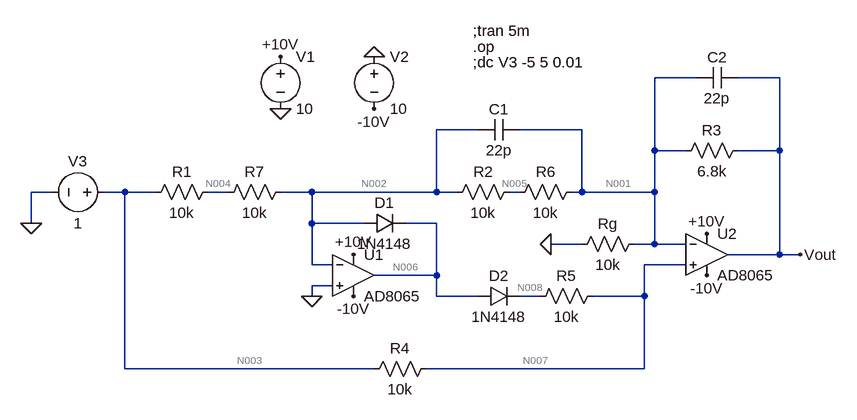
[diagram p0: schematic Etaj4.asc]
Etaj4.asc, the LTspice schematic file:
Version 4.1
SHEET 1 1336 680
WIRE 736 -96 672 -96
WIRE 864 -96 800 -96
WIRE 400 -16 336 -16
WIRE 560 -16 464 -16
WIRE 672 16 672 -96
WIRE 720 16 672 16
WIRE 864 16 864 -96
WIRE 864 16 800 16
WIRE -256 80 -288 80
WIRE -144 80 -176 80
WIRE -96 80 -144 80
WIRE 16 80 -16 80
WIRE 144 80 96 80
WIRE 336 80 336 -16
WIRE 336 80 144 80
WIRE 368 80 336 80
WIRE 464 80 448 80
WIRE 560 80 560 -16
WIRE 560 80 544 80
WIRE 672 80 672 16
WIRE 672 80 560 80
WIRE -288 128 -288 80
WIRE 144 128 144 80
WIRE 224 128 144 128
WIRE 336 128 288 128
WIRE 560 160 512 160
WIRE 672 160 672 80
WIRE 672 160 640 160
WIRE 720 160 672 160
WIRE 864 176 864 16
WIRE 864 176 784 176
WIRE 896 176 864 176
WIRE 144 192 144 128
WIRE 176 192 144 192
WIRE 720 192 656 192
WIRE 336 208 336 128
WIRE 336 208 240 208
WIRE 176 224 144 224
WIRE 144 240 144 224
WIRE 336 240 336 208
WIRE 400 240 336 240
WIRE 496 240 464 240
WIRE 656 240 656 192
WIRE 656 240 576 240
WIRE -144 352 -144 80
WIRE 240 352 -144 352
WIRE 656 352 656 240
WIRE 656 352 320 352
FLAG 144 240 0
FLAG 896 176 Vout
FLAG 96 -48 0
FLAG 240 -128 0
FLAG 96 -128 +10V
FLAG 208 176 +10V
FLAG 752 144 +10V
FLAG 240 -48 -10V
FLAG 208 240 -10V
FLAG 752 208 -10V
FLAG -288 128 0
FLAG 512 160 0
SYMBOL res 0 64 R90
WINDOW 0 0 56 VBottom 2
WINDOW 3 32 56 VTop 2
SYMATTR InstName R1
SYMATTR Value 10k
SYMBOL OpAmps\\AD8065 208 144 R0
SYMATTR InstName U1
SYMBOL diode 224 144 R270
WINDOW 0 32 32 VTop 2
WINDOW 3 0 32 VBottom 2
SYMATTR InstName D1
SYMATTR Value 1N4148
SYMBOL diode 400 256 R270
WINDOW 0 32 32 VTop 2
WINDOW 3 0 32 VBottom 2
SYMATTR InstName D2
SYMATTR Value 1N4148
SYMBOL res 336 336 R90
WINDOW 0 0 56 VBottom 2
WINDOW 3 32 56 VTop 2
SYMATTR InstName R4
SYMATTR Value 10k
SYMBOL res 464 64 R90
WINDOW 0 0 56 VBottom 2
WINDOW 3 32 56 VTop 2
SYMATTR InstName R2
SYMATTR Value 10k
SYMBOL OpAmps\\AD8065 752 112 R0
SYMATTR InstName U2
SYMBOL res 816 0 R90
WINDOW 0 0 56 VBottom 2
WINDOW 3 32 56 VTop 2
SYMATTR InstName R3
SYMATTR Value 6.8k
SYMBOL voltage 96 -144 R0
WINDOW 123 0 0 Left 0
WINDOW 39 0 0 Left 0
SYMATTR InstName V1
SYMATTR Value 10
SYMBOL voltage 240 -144 R0
WINDOW 123 0 0 Left 0
WINDOW 39 0 0 Left 0
SYMATTR InstName V2
SYMATTR Value 10
SYMBOL voltage -160 80 R90
WINDOW 0 -32 56 VBottom 2
WINDOW 3 32 56 VTop 2
WINDOW 123 0 0 Left 0
WINDOW 39 0 0 Left 0
SYMATTR InstName V3
SYMATTR Value 1
SYMBOL cap 464 -32 R90
WINDOW 0 0 32 VBottom 2
WINDOW 3 32 32 VTop 2
SYMATTR InstName C1
SYMATTR Value 22p
SYMBOL cap 800 -112 R90
WINDOW 0 0 32 VBottom 2
WINDOW 3 32 32 VTop 2
SYMATTR InstName C2
SYMATTR Value 22p
SYMBOL res 656 144 R90
WINDOW 0 0 56 VBottom 2
WINDOW 3 32 56 VTop 2
SYMATTR InstName Rg
SYMATTR Value 10k
SYMBOL res 592 224 R90
WINDOW 0 0 56 VBottom 2
WINDOW 3 32 56 VTop 2
SYMATTR InstName R5
SYMATTR Value 10k
SYMBOL res 560 64 R90
WINDOW 0 0 56 VBottom 2
WINDOW 3 32 56 VTop 2
SYMATTR InstName R6
SYMATTR Value 10k
SYMBOL res 112 64 R90
WINDOW 0 0 56 VBottom 2
WINDOW 3 32 56 VTop 2
SYMATTR InstName R7
SYMATTR Value 10k
TEXT 392 -168 Left 2 !;tran 5m
TEXT 392 -144 Left 2 !.op
TEXT 392 -120 Left 2 !;dc V3 -5 5 0.01

The netlist it stands for:
* Etaj4.asc
R1 N004 N003 10k
X§U1 0 N002 +10V -10V N006 AD8065  ; pins In+ In- V+ V- OUT
D1 N002 N006 1N4148
D2 N006 N008 1N4148
R4 N007 N003 10k
R2 N005 N002 10k
X§U2 N007 N001 +10V -10V Vout AD8065  ; pins In+ In- V+ V- OUT
R3 Vout N001 6.8k
V1 +10V 0 10
V2 0 -10V 10
V3 N003 0 1
C1 N001 N002 22p
C2 Vout N001 22p
Rg N001 0 10k
R5 N007 N008 10k
R6 N001 N005 10k
R7 N002 N004 10k
.model D D
.lib standard.dio
;tran 5m
.op
;dc V3 -5 5 0.01
.backanno
.end

* Results of the author's LTspice run, read from the files saved beside the schematic
* Operating Point:
*   V(n003) = 1 V
*   V(+10v) = 10 V
*   V(-10v) = -10 V
*   V(n008) = 999.9 mV
*   V(n001) = 1 V
*   V(n004) = 500.2 mV
*   V(n002) = 401.1 µV
*   V(n006) = -479.5 mV
*   V(n007) = 1 V
*   V(n005) = 500.4 mV
*   V(vout) = 2.021 V
*   I(R4) = -2.524 nA
*   I(R3) = 150 µA
*   I(V1) = -12.95 mA
*   I(R6) = 50 µA
*   I(R1) = -49.98 µA
*   I(D2) = -2.521 nA
*   I(V3) = -49.98 µA
*   I(Rg) = 100 µA
*   I(R2) = 50 µA
*   I(R5) = 2.521 nA
*   I(R7) = -49.98 µA
*   I(D1) = 99.98 µA
*   I(V2) = -12.9 mA
*   I(C1) = 0 A
*   I(C2) = 0 A
*   Ix(u2:1) = 3 pA
*   Ix(u2:2) = 2.001 pA
*   Ix(u2:3) = 6.55 mA
*   Ix(u2:4) = -6.4 mA
*   Ix(u2:5) = -150 µA
*   Ix(u1:1) = 2 pA
*   Ix(u1:2) = 1.001 pA
*   Ix(u1:3) = 6.4 mA
*   Ix(u1:4) = -6.5 mA
*   Ix(u1:5) = 99.98 µA